# EAGLE schematic MotorChip (EAGLE 7.6.0)
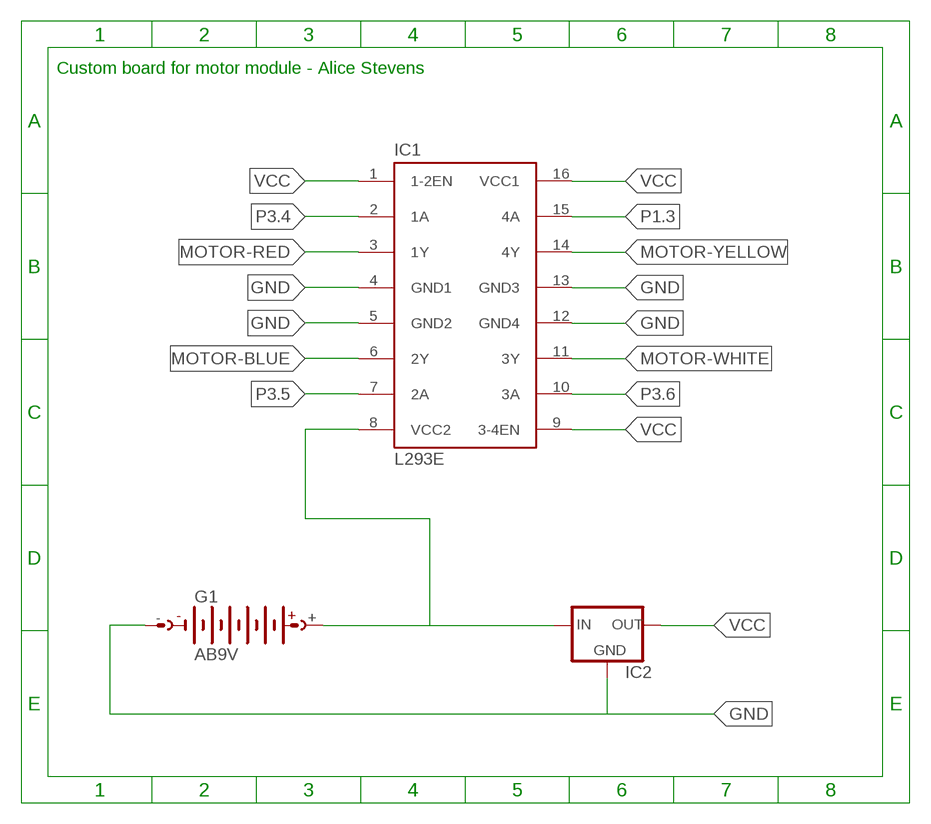
[diagram p0: schematic, sheet 1]

## Parts
G1  AB9V  [AB9V]
IC1  L293E  [DIL16]
IC2  78XXL  [78XXL]

## Nets
9V: G1.+ IC1.8(VCC2) IC2.IN
GND: G1.- IC1.4(GND1) IC1.5(GND2) IC1.12(GND4) IC1.13(GND3) IC2.GND
MOTOR-BLUE: IC1.6(2Y)
MOTOR-RED: IC1.3(1Y)
MOTOR-WHITE: IC1.11(3Y)
MOTOR-YELLOW: IC1.14(4Y)
P1.3: IC1.15(4A)
P3.4: IC1.2(1A)
P3.5: IC1.7(2A)
P3.6: IC1.10(3A)
VCC: IC1.1(1-2EN) IC1.9(3-4EN) IC1.16(VCC1) IC2.OUT

## Notes on the sheet
- Custom board for motor module - Alice Stevens

## Library data of the parts
G1 = battery:AB9V: 9-V BATTERY CLIP
IC1 = texas:L293E: TI DEVICE; MF: Arrow Electronics; MPN: L293E; OC_FARNELL: 1467711; OC_NEWARK: 89K0732
IC2 = v-reg:78XXL: VOLTAGE REGULATOR